# Altium schematic sheet Sheet_1.schdoc
size 346 x 294 mm
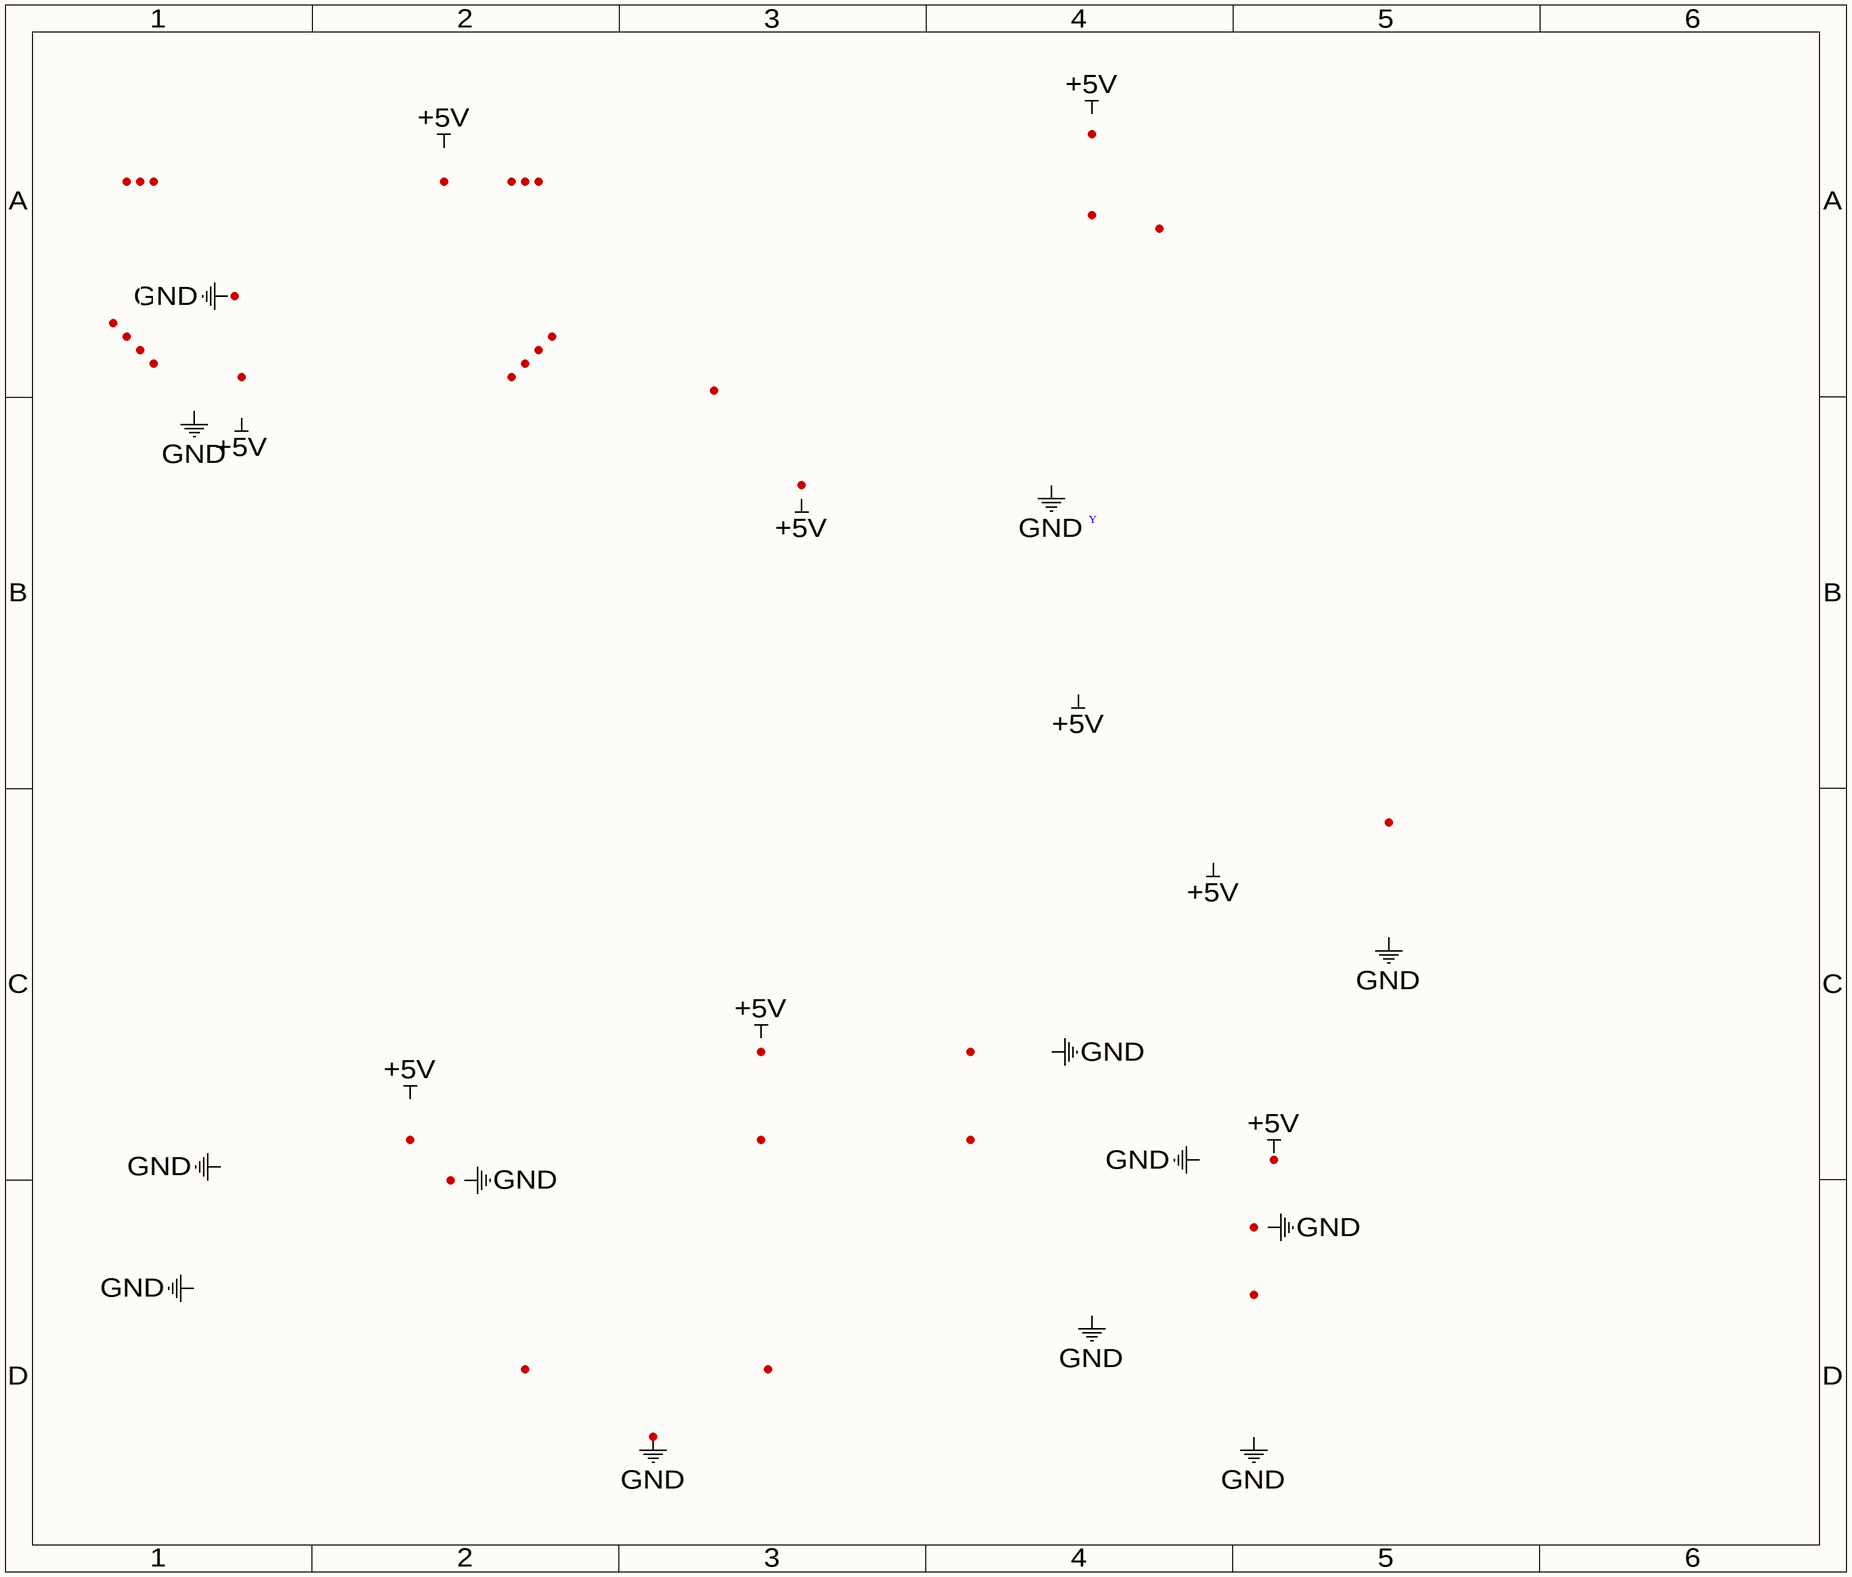
[diagram p0: Sheet_1.schdoc]

## Parts
BOARD1  ESP32DEVKITV1  [ESP32-DEVKITV1]  (value not drawn)
C1  100nF  [C0402]
C2  100nF  [C0402]
C3  100nF  [C0402]
C4  100nF  [C0402]
C5  100nF  [C0402]
C6  100nF  [C0402]
D1  SS34  [SMA_L4.4-W2.8-LS5.4-RD]
D2  SS34  [SMA_L4.4-W2.8-LS5.4-RD]
ERROR  17-21SURC/S530-A2/TR8  [LED0805-RD]  (value not drawn)
GC  17-21SURC/S530-A2/TR8  [LED0805-RD]  (value not drawn)
GL  17-21SURC/S530-A2/TR8  [LED0805-RD]  (value not drawn)
GR  17-21SURC/S530-A2/TR8  [LED0805-RD]  (value not drawn)
K1  KH-3635-CAJ  [SW-SMD_KH-3635-CAJ]  (value not drawn)
K2  KH-3635-CAJ  [SW-SMD_KH-3635-CAJ]  (value not drawn)
OLED1  0.96OLED_4P  [0.96OLED_4P]
OPEN  SK-3296S-01-L1  [SW-SMD_3P-P1.50_L2.7-W6.6]  (value not drawn)
POWER  17-21SYGC/S530-E3/TR8  [LED0805-RD]  (value not drawn)
R1  510  [R0603]
R2  1k  [R0603]
R3  1k  [R0603]
R4  4.7k  [R0603]
R5  4.7k  [R0603]
RC  17-21SURC/S530-A2/TR8  [LED0805-RD]  (value not drawn)
RL  17-21SURC/S530-A2/TR8  [LED0805-RD]  (value not drawn)
RN1  1k  [RES-ARRAY-SMD_0603-8P-L3.2-W1.6-BL]
RN2  1k  [RES-ARRAY-SMD_0603-8P-L3.2-W1.6-BL]
RN3  1k  [RES-ARRAY-SMD_0603-8P-L3.2-W1.6-BL]
RN4  1k  [RES-ARRAY-SMD_0603-8P-L3.2-W1.6-BL]
RR  17-21SURC/S530-A2/TR8  [LED0805-RD]  (value not drawn)
U1  PCF8574T/3,518  [SOIC-16_L10.3-W7.5-P1.27-LS10.3-BL]
U2  74HC240D,653  [SOIC-20_L13.0-W7.6-P1.27-LS10.6-BL]
U3  74HC30D,653  [SOIC-14_L8.7-W3.9-P1.27-LS6.0-BL]
U4  74HC30D,653  [SOIC-14_L8.7-W3.9-P1.27-LS6.0-BL]
U5  AMS1117-3.3_C347222  [SOT-223_L6.7-W3.5-P2.30-BR]
U6  74HC30D,653  [SOIC-14_L8.7-W3.9-P1.27-LS6.0-BL]
U7  74HC30D,653  [SOIC-14_L8.7-W3.9-P1.27-LS6.0-BL]
U8  74HC08D,653  [SOIC-14_L8.7-W3.9-P1.27-LS6.0-BL]
USB1  KH-TYPE-C-6P  [TYPE-C-SMD_TYPE-C-31-M-16]
YL  17-21SURC/S530-A2/TR8  [LED0805-RD]  (value not drawn)
YR  17-21SURC/S530-A2/TR8  [LED0805-RD]  (value not drawn)

## Blocks framed on the sheet
LED驱动模块: C4 RN3 RN4 U1
交通灯模组: GC GL GR RC RL RN1 RN2 RR YL YR
电源模块: C3 OPEN POWER R1 U5 USB1
数字逻辑电路: C1 C5 C6 ERROR R2 U2-U4 U6-U8

## Nets
+5V: C1.2 C2.1 C4.2 C5.2 C6.1 D1.2(A) OPEN.1 R4.2 R5.2 RN3.5 RN3.6 RN3.7 RN3.8 RN4.5 RN4.6 RN4.7 RN4.8 U1.16(VDD) U2.20(VCC) U3.14(VCC) U4.14(VCC) U5.3(VIN) U6.14(VCC) U7.14(VCC) U8.14(VCC)
GND: BOARD1.GND BOARD1.GND@1(GND) C1.1 C2.2 C3.2 C4.1 C5.1 C6.2 ERROR.1(K) GC.1(K) GL.1(K) GR.1(K) K1.2(D) K1.4(B) K2.2(D) K2.4(B) OLED1.1 POWER.1(K) RC.1(K) RL.1(K) RR.1(K) U1.1(A0) U1.2(A1) U1.3(A2) U1.8(VSS) U2.1(1OE#) U2.10(GND) U2.19(2OE#) U3.7(GND) U4.7(GND) U5.1(ADJ(GND)) U6.7(GND) U7.7(GND) U8.7(GND) U8.12(4A) U8.13(4B) USB1.1(EP) USB1.2(EP) USB1.3(EP) USB1.4(EP) USB1.A12(GND) USB1.B12(GND) YL.1(K) YR.1(K)
+3.3V: C3.1 OLED1.2 R1.2 U5.2(VOUT(TAB)) U5.4(TAB)
A: RN1.8 RN3.1 U1.4(P0) U2.2(1A0) U3.1(A)
A`: U2.18(1Y0) U4.1(A) U6.1(A) U7.1(A)
B: RN1.7 RN3.2 U1.5(P1) U2.4(1A1) U7.2(B)
B`: U2.16(1Y1) U3.2(B) U4.2(B) U6.2(B)
C: RN1.6 RN3.3 U1.6(P2) U2.6(1A2) U4.3(C) U6.3(C)
C`: U2.14(1Y2) U3.3(C) U7.3(C)
D: RN1.5 RN3.4 U1.7(P3) U2.8(1A3) U4.4(D) U6.4(D)
D`: U2.12(1Y3) U3.4(D) U7.4(D)
DC: OPEN.2 USB1.A9(VBUS) USB1.B9(VBUS)
E: RN2.8 RN4.1 U1.9(P4) U2.17(2A0) U7.5(E)
E`: U2.3(2Y0) U3.5(E) U4.5(E) U6.5(E)
F: RN2.7 RN4.2 U1.10(P5) U2.15(2A1) U3.6(F)
F`: U2.5(2Y1) U4.6(F) U6.6(F) U7.6(F)
G: RN2.6 RN4.3 U1.11(P6) U2.13(2A2) U3.11(G) U4.11(G) U7.11(G)
G`: U2.7(2Y2) U6.11(G)
H: RN2.5 RN4.4 U1.12(P7) U2.11(2A3) U6.12(H)
H`: U2.9(2Y3) U3.12(H) U4.12(H) U7.12(H)
K1: BOARD1.D17 K1.1(C)
K2: BOARD1.D16 K2.1(C)
SCL: BOARD1.D23 OLED1.3 R4.1 U1.14(SCL)
SDA: BOARD1.D22 OLED1.4 R5.1 U1.15(SDA)
Y: R2.2 R3.1 U8.8(3Y)
Y1: U3.8(Y) U8.1(1A)
Y2: U4.8(Y) U8.2(1B)
Y3: U6.8(Y) U8.5(2B)
Y4: U7.8(Y) U8.10(3B)
NetBOARD1_D15: BOARD1.D15 D2.1(C)
NetBOARD1_VIN: BOARD1.VIN D1.1(C)
NetD2_2: D2.2(A) R3.2
NetERROR_2: ERROR.2(A) R2.1
NetGC_2: GC.2(A) RN2.4
NetGL_2: GL.2(A) RN1.3
NetGR_2: GR.2(A) RN2.2
NetPOWER_2: POWER.2(A) R1.1
NetRC_2: RC.2(A) RN2.3
NetRL_2: RL.2(A) RN1.1
NetRN1_2: RN1.2 YL.2(A)
NetRN1_4: RN1.4 RR.2(A)
NetRN2_1: RN2.1 YR.2(A)
NetU8_3: U8.3(1Y) U8.4(2A)
NetU8_6: U8.6(2Y) U8.9(3A)

Not connected (* = marked no-connect by the designer): BOARD1 3V3 D1 D2 D3 D4 D5 D12 D13 D14 D18 D19 D21 D25 D26 D27 D32 D33 D34 D35 EN VN VP; K1 3(A); K2 3(A); OPEN 0 3; U1 13(INT#); U3 9(N.C.) 10(N.C./3) 13(N.C./2); U4 9(N.C.) 10(N.C./3) 13(N.C./2); U6 9(N.C.) 10(N.C./3) 13(N.C./2); U7 9(N.C.) 10(N.C./3) 13(N.C./2); U8 11(4Y); USB1 A5(CC1) B5(CC2)

## Notes on the sheet
- 主控
- (in symbol 0.96OLED_4P) Hello World!!!
- (in symbol ESP32DEVKITV1) ESPRESSIF; ESP32-WROOM-32; WI; FI; ESP32-DEVKITV1

## Library data of the parts
BOARD1 = ESP32DEVKITV1: Contributor: radio; Package Display: No; spicePre: B; spiceSymbolName: ESP32DEVKITV1
C1-C6 = 100nF: BOM_Manufacturer: Prosperity Dielectrics; BOM_Manufacturer Part: FN15X104K160PNG; nameAlias: Capacitance; Contributor: LCSC; BOM_Supplier: LCSC; BOM_Supplier Part: C328914; spicePre: C; spiceSymbolName: FN15X104K160PNG
D1 D2 = SS34: BOM_Manufacturer: STARSEA; BOM_Paste Type: expand; BOM_Supplier: LCSC; BOM_Manufacturer Part: SS34; image: //image.lceda.cn/szlcsc/C83961.jpg; BOM_Supplier Part: C83961; spicePre: D; spiceSymbolName: SS34_C83961
ERROR GC GL GR RC RL RR YL YR = 17-21SURC/S530-A2/TR8: BOM_Manufacturer: EVERLIGHT; Contributor: LCSC; BOM_Paste Type: recommend; BOM_Supplier: LCSC; BOM_Manufacturer Part: 17-21SURC/S530-A2/TR8; BOM_Supplier Part: C131244; spicePre: L; spiceSymbolName: 17-21SURC/S530-A2/TR8
K1 K2 = KH-3635-CAJ: BOM_Manufacturer: Shenzhen Kinghelm Elec; Contributor: LCSC; BOM_Paste Type: expand; BOM_Supplier: LCSC; BOM_Supplier Part: C530670; BOM_Manufacturer Part: KH-3635-CAJ; spicePre: S; spiceSymbolName: KH-3635-CAJ
OLED1 = 0.96OLED_4P: Contributor: LCEDA_Lib; BOM_Supplier: LCSC; spicePre: O; spiceSymbolName: 0.96OLED_4P
OPEN = SK-3296S-01-L1: BOM_Manufacturer: XKB Enterprise; Contributor: LCSC; BOM_Supplier: LCSC; BOM_Supplier Part: C319020; BOM_Manufacturer Part: SK-3296S-01-L1; spicePre: S; spiceSymbolName: SK-3296S-01-L1
POWER = 17-21SYGC/S530-E3/TR8: BOM_Manufacturer: EVERLIGHT; Contributor: LCSC; BOM_Paste Type: recommend; BOM_Supplier: LCSC; BOM_Manufacturer Part: 17-21SYGC/S530-E3/TR8; BOM_Supplier Part: C142303; spicePre: L; spiceSymbolName: 17-21SYGC/S530-E3/TR8
R1 = 510: BOM_Manufacturer: UniOhm; BOM_Manufacturer Part: 0603WAF1002T5E; nameAlias: Resistance (Ohms); BOM_Paste Type: base; BOM_Supplier: LCSC; BOM_Supplier Part: C25804; spicePre: R; spiceSymbolName: 0603WAF1002T5E
R2 R3 = 1k: BOM_Manufacturer: UniOhm; BOM_Manufacturer Part: 0603WAF1002T5E; nameAlias: Resistance (Ohms); BOM_Paste Type: base; BOM_Supplier: LCSC; BOM_Supplier Part: C25804; spicePre: R; spiceSymbolName: 0603WAF1002T5E
R4 R5 = 4.7k: BOM_Manufacturer: UniOhm; BOM_Manufacturer Part: 0603WAF1002T5E; nameAlias: Resistance (Ohms); BOM_Paste Type: base; BOM_Supplier: LCSC; BOM_Supplier Part: C25804; spicePre: R; spiceSymbolName: 0603WAF1002T5E
RN1-RN4 = 1k: BOM_Manufacturer: YAGEO; BOM_Manufacturer Part: YC164-FR-071KL; nameAlias: Resistance (Ohms); BOM_Supplier: LCSC; BOM_Supplier Part: C110021; spicePre: R; spiceSymbolName: YC164-FR-071KL
U1 = PCF8574T/3,518: BOM_Manufacturer: NXP; BOM_Paste Type: recommend; BOM_Supplier: LCSC; BOM_Manufacturer Part: PCF8574T/3,518; image: //image.lceda.cn/szlcsc/C7605.jpg; BOM_Supplier Part: C7605; spicePre: U; spiceSymbolName: PCF8574T/3,518
U2 = 74HC240D,653: BOM_Manufacturer: Nexperia; BOM_Paste Type: expand; BOM_Supplier: LCSC; BOM_Manufacturer Part: 74HC240D,653; image: //image.lceda.cn/szlcsc/C8094.jpg; BOM_Supplier Part: C8094; spicePre: U; spiceSymbolName: 74HC240D,653
U3 U4 U6 U7 = 74HC30D,653: BOM_Manufacturer: Nexperia; BOM_Paste Type: expand; spicePre: X; BOM_Supplier: LCSC; BOM_Manufacturer Part: 74HC30D,653; image: //image.lceda.cn/szlcsc/C5631.jpg; BOM_Supplier Part: C5631; spiceSymbolName: 74HC30D,653
U5 = AMS1117-3.3_C347222: BOM_Manufacturer: Youtai Semiconductor Co., Ltd.; Contributor: LCSC; BOM_Paste Type: expand; BOM_Supplier: LCSC; BOM_Supplier Part: C347222; BOM_Manufacturer Part: AMS1117-3.3; spicePre: U; spiceSymbolName: AMS1117-3.3_C347222
U8 = 74HC08D,653: BOM_Manufacturer: Nexperia; BOM_Paste Type: base; BOM_Supplier: LCSC; BOM_Manufacturer Part: 74HC08D,653; image: //image.lceda.cn/szlcsc/C5593.jpg; BOM_Supplier Part: C5593; spicePre: U; spiceSymbolName: 74HC08D,653
USB1 = KH-TYPE-C-6P: BOM_Manufacturer: Shenzhen Kinghelm Elec; Contributor: LCSC; BOM_Paste Type: expand; BOM_Supplier: LCSC; BOM_Supplier Part: C709355; BOM_Manufacturer Part: KH-TYPE-C-6P; spicePre: U; spiceSymbolName: KH-TYPE-C-6P